# EAGLE design TCS531000_ROM-el_v1 (EAGLE 7.7.0)
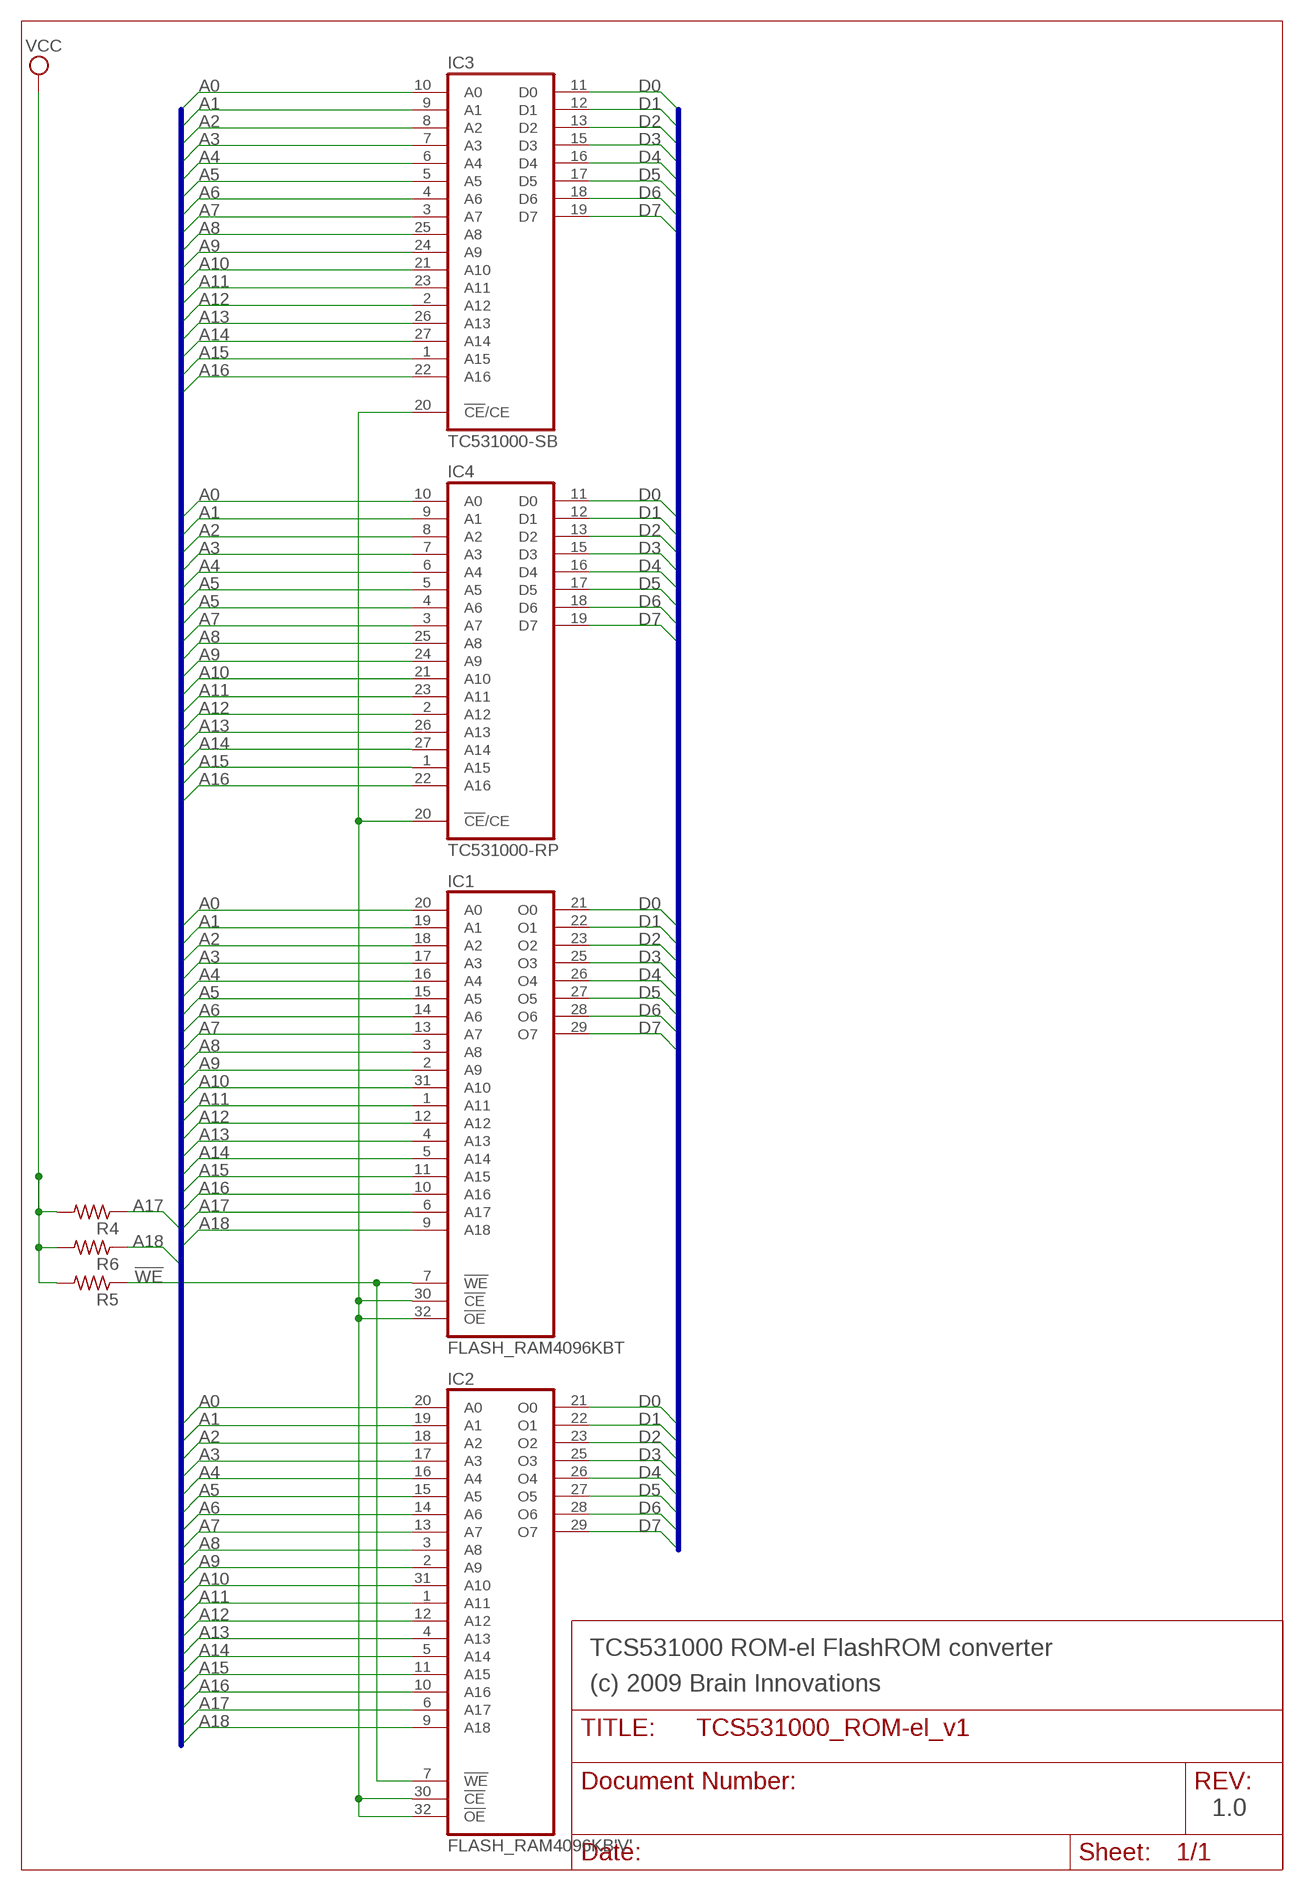
[diagram p0: schematic, sheet 1]

## Parts
IC1  FLASH_RAM4096KBT  FLASH_RAM4096KB'T'  [TSOP32]
IC2  FLASH_RAM4096KB'V'  [VSOP32]
IC3  TC531000-SB  [DIL28-SMD-REVERSE]
IC4  TC531000-RP  [DIL28-ROUNDPAD]
R4  R-US_R0805  [R0805]
R5  R-US_R0805  [R0805]
R6  R-US_R0805  [R0805]

## Nets
!WE: IC1.7(!WE) IC2.7(!WE) R5.1
A0: IC1.20(A0) IC2.20(A0) IC3.10(A0) IC4.10(A0)
A1: IC1.19(A1) IC2.19(A1) IC3.9(A1) IC4.9(A1)
A2: IC1.18(A2) IC2.18(A2) IC3.8(A2) IC4.8(A2)
A3: IC1.17(A3) IC2.17(A3) IC3.7(A3) IC4.7(A3)
A4: IC1.16(A4) IC2.16(A4) IC3.6(A4) IC4.6(A4)
A5: IC1.15(A5) IC2.15(A5) IC3.5(A5) IC4.5(A5)
A6: IC1.14(A6) IC2.14(A6) IC3.4(A6) IC4.4(A6)
A7: IC1.13(A7) IC2.13(A7) IC3.3(A7) IC4.3(A7)
A8: IC1.3(A8) IC2.3(A8) IC3.25(A8) IC4.25(A8)
A9: IC1.2(A9) IC2.2(A9) IC3.24(A9) IC4.24(A9)
A10: IC1.31(A10) IC2.31(A10) IC3.21(A10) IC4.21(A10)
A11: IC1.1(A11) IC2.1(A11) IC3.23(A11) IC4.23(A11)
A12: IC1.12(A12) IC2.12(A12) IC3.2(A12) IC4.2(A12)
A13: IC1.4(A13) IC2.4(A13) IC3.26(A13) IC4.26(A13)
A14: IC1.5(A14) IC2.5(A14) IC3.27(A14) IC4.27(A14)
A15: IC1.11(A15) IC2.11(A15) IC3.1(A15) IC4.1(A15)
A16: IC1.10(A16) IC2.10(A16) IC3.22(A16) IC4.22(A16)
A17: IC1.6(A17) IC2.6(A17) R4.1
A18: IC1.9(A18) IC2.9(A18) R6.1
D0: IC1.21(O0) IC2.21(O0) IC3.11(D0) IC4.11(D0)
D1: IC1.22(O1) IC2.22(O1) IC3.12(D1) IC4.12(D1)
D2: IC1.23(O2) IC2.23(O2) IC3.13(D2) IC4.13(D2)
D3: IC1.25(O3) IC2.25(O3) IC3.15(D3) IC4.15(D3)
D4: IC1.26(O4) IC2.26(O4) IC3.16(D4) IC4.16(D4)
D5: IC1.27(O5) IC2.27(O5) IC3.17(D5) IC4.17(D5)
D6: IC1.28(O6) IC2.28(O6) IC3.18(D6) IC4.18(D6)
D7: IC1.29(O7) IC2.29(O7) IC3.19(D7) IC4.19(D7)
N$1: IC1.30(!CE) IC1.32(!OE) IC2.30(!CE) IC2.32(!OE) IC3.20(!CE!/CE) IC4.20(!CE!/CE)
VCC: R4.2 R5.2 R6.2

## Buses
A[0..18]
D[0..7]

## Notes on the sheet
- TCS531000 ROM-el FlashROM converter
- (c) 2009 Brain Innovations
- 1.0

## Power pins joined to a net without a drawn wire
GND: IC1.24(GND) IC2.24(GND) IC3.14(GND) IC4.14(GND)
VCC: IC1.8(VCC) IC2.8(VCC) IC3.28(VCC) IC4.28(VCC)

## Library data of the parts
IC1 IC2 = memory-jedec:FLASH_RAM4096KB
IC3 IC4 = memory-toshiba-jlb:TC531000: MEMORY
R4-R6 = resistor:R-US_: RESISTOR, American symbol

## Board
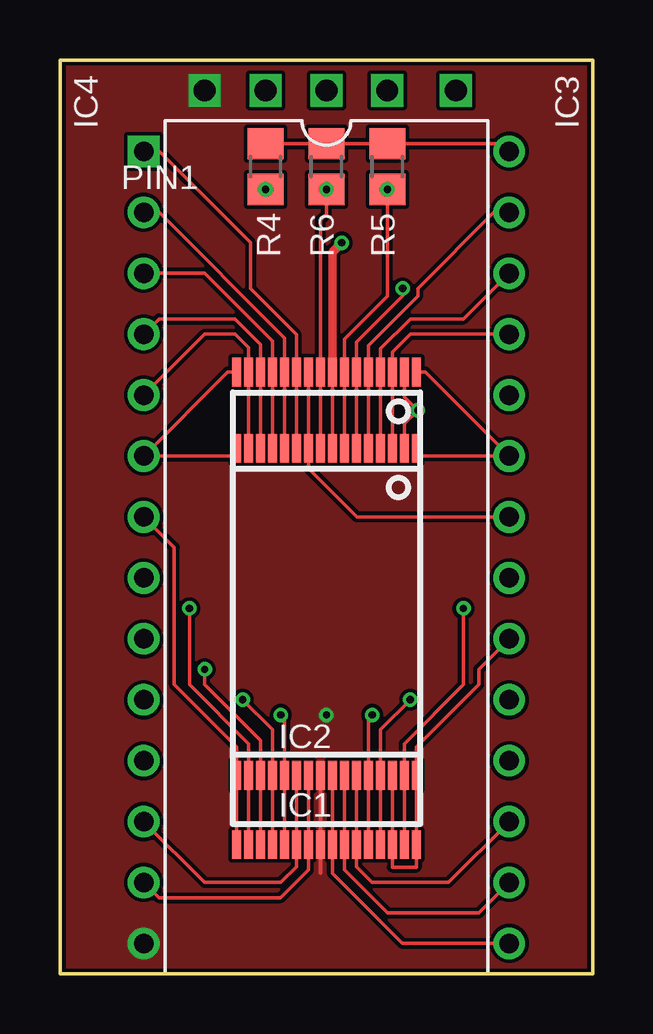
[diagram p1: board, top side]
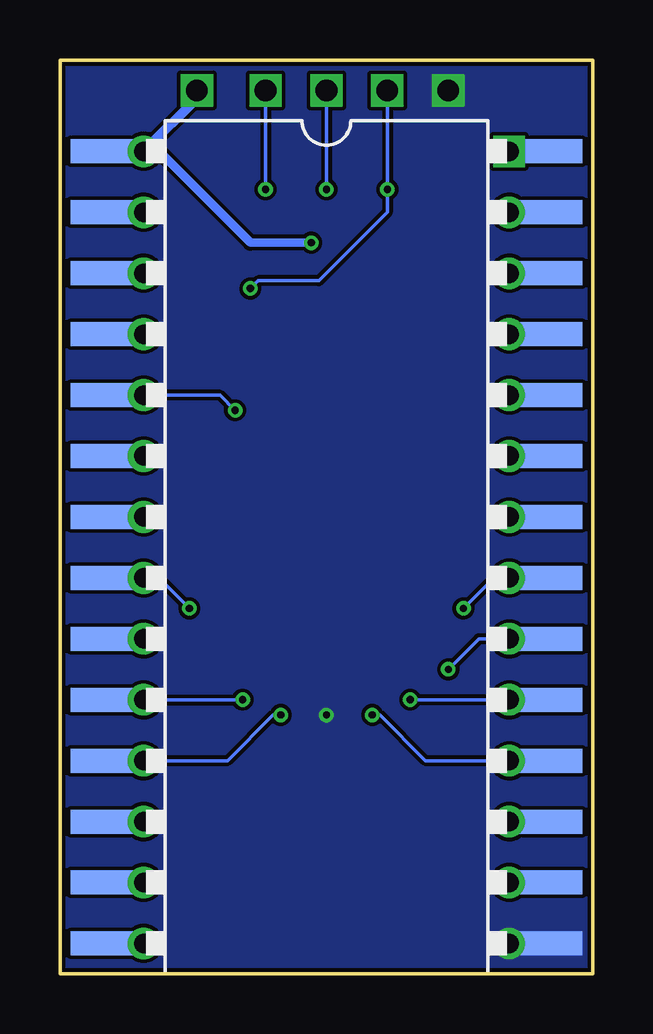
[diagram p2: board, bottom side, seen from below]

Size 22.23 x 38.1 mm. Coordinates in mm from the lower left corner, seen from the top.
Outline: 0,0 22.23,0 22.23,38.1 0,38.1 0,0
Copper layers (1*16): Top 0.035mm / dielectric 1.5mm / Bottom 0.035mm
Design rules "hackvana *": minimum track width 6mil, minimum drill 0.3mm, track to track 6mil, track to pad 6mil, pad to pad 6mil, via to via 6mil, smd to smd 0mil, copper to edge 6mil, drill to drill 6mil, minimum pad ring 10mil, minimum via ring 6mil, stop-mask expansion 2mil, vias tented up to drill 100mil, thermal gap 10mil

### Footprints (pad centres in the part's own frame; a part is rotated, then mirrored left to right if it is on the bottom)
TSOP32 = smd 1.2 x 0.36: 1 -9.85,3.75; 2 -9.85,3.25; 3 -9.85,2.75; 4 -9.85,2.25; 5 -9.85,1.75; 6 -9.85,1.25; 7 -9.85,0.75; 8 -9.85,0.25; 9 -9.85,-0.25; 10 -9.85,-0.75; 11 -9.85,-1.25; 12 -9.85,-1.75; 13 -9.85,-2.25; 14 -9.85,-2.75; 15 -9.85,-3.25; 16 -9.85,-3.75; 17 9.85,-3.75; 18 9.85,-3.25; 19 9.85,-2.75; 20 9.85,-2.25; 21 9.85,-1.75; 22 9.85,-1.25; 23 9.85,-0.75; 24 9.85,-0.25; 25 9.85,0.25; 26 9.85,0.75; 27 9.85,1.25; 28 9.85,1.75; 29 9.85,2.25; 30 9.85,2.75; 31 9.85,3.25; 32 9.85,3.75
VSOP32 = smd 1.2 x 0.36: 1 -7.31,3.75; 2 -7.31,3.25; 3 -7.31,2.75; 4 -7.31,2.25; 5 -7.31,1.75; 6 -7.31,1.25; 7 -7.31,0.75; 8 -7.31,0.25; 9 -7.31,-0.25; 10 -7.31,-0.75; 11 -7.31,-1.25; 12 -7.31,-1.75; 13 -7.31,-2.25; 14 -7.31,-2.75; 15 -7.31,-3.25; 16 -7.31,-3.75; 17 6.322,-3.75; 18 6.322,-3.25; 19 6.322,-2.75; 20 6.322,-2.25; 21 6.322,-1.75; 22 6.322,-1.25; 23 6.322,-0.75; 24 6.322,-0.25; 25 6.322,0.25; 26 6.322,0.75; 27 6.322,1.25; 28 6.322,1.75; 29 6.322,2.25; 30 6.322,2.75; 31 6.322,3.25; 32 6.322,3.75
DIL28-SMD-REVERSE = smd 1 x 3.5 bottom: 1 -16.51,-8.92; 2 -13.97,-8.92; 3 -11.43,-8.92; 4 -8.89,-8.92; 5 -6.35,-8.92; 6 -3.81,-8.92; 7 -1.27,-8.92; 8 1.27,-8.92; 9 3.81,-8.92; 10 6.35,-8.92; 11 8.89,-8.92; 12 11.43,-8.92; 13 13.97,-8.92; 14 16.51,-8.92; 15 16.51,8.92; 16 13.97,8.92; 17 11.43,8.92; 18 8.89,8.92; 19 6.35,8.92; 20 3.81,8.92; 21 1.27,8.92; 22 -1.27,8.92; 23 -3.81,8.92; 24 -6.35,8.92; 25 -8.89,8.92; 26 -11.43,8.92; 27 -13.97,8.92; 28 -16.51,8.92
DIL28-ROUNDPAD = drill 0.813 square: 1 -16.51,-7.62 | drill 0.813: 2 -13.97,-7.62; 3 -11.43,-7.62; 4 -8.89,-7.62; 5 -6.35,-7.62; 6 -3.81,-7.62; 7 -1.27,-7.62; 8 1.27,-7.62; 9 3.81,-7.62; 10 6.35,-7.62; 11 8.89,-7.62; 12 11.43,-7.62; 13 13.97,-7.62; 14 16.51,-7.62; 15 16.51,7.62; 16 13.97,7.62; 17 11.43,7.62; 18 8.89,7.62; 19 6.35,7.62; 20 3.81,7.62; 21 1.27,7.62; 22 -1.27,7.62; 23 -3.81,7.62; 24 -6.35,7.62; 25 -8.89,7.62; 26 -11.43,7.62; 27 -13.97,7.62; 28 -16.51,7.62
R0805 = smd 1.3 x 1.5: 1 -0.95,0; 2 0.95,0

### Placement (x,y rotation side)
IC1  11.11,15.24 270 top
IC2  11.11,14.61 270 top
IC3  11.11,17.78 270 top
IC4  11.11,17.78 270 top
R4  8.57,33.66 90 top
R5  13.65,33.66 90 top
R6  11.11,33.66 90 top

### Tracks (layer width: path | path; a pad name or v marks a point on that pad's centre or on a via)
!WE  (via drill 0.3, 0.9)
  Top 0.152: R5.1 13.65,28.26 11.86,26.47 IC1.7 IC2.7
  Bottom 0.152: v13.65,36.83 R5.1
  other vias: 13.65,32.7
A0  (via drill 0.3)
  Top 0.152: v7.62,11.43 8.86,10.19 IC1.20 IC2.20
  Bottom 0.152: IC3.10 IC4.10 v7.62,11.43
A1  (via drill 0.3)
  Top 0.152: v6.03,12.7 6.03,12.06 8.36,9.73 IC2.19 IC1.19
  Bottom 0.152: IC3.9 IC4.9 4.76,13.97 v6.03,12.7
A2  (via drill 0.3)
  Top 0.152: v5.4,15.24 5.4,12.06 7.86,9.6 IC2.18 IC1.18
  Bottom 0.152: IC3.8 IC4.8 4.13,16.51 v5.4,15.24
A3
  Top 0.152: IC4.7 4.76,17.78 4.76,12.06 7.36,9.46 IC1.17 IC2.17
  Bottom 0.152: IC3.7 IC4.7
A4
  Top 0.152: IC1.16 6.99,25.09 IC4.6 | IC4.6 | IC4.6 7.3,21.59 7.3,21.91 IC2.16
  Bottom 0.152: IC3.6 IC4.6
A5
  Top 0.152: IC4.5 6.03,26.67 7.3,26.67 7.86,26.11 IC1.15 IC2.15
  Bottom 0.152: IC3.5 IC4.5
A6
  Top 0.152: IC4.4 4.13,27.3 7.3,27.3 8.36,26.25 IC1.14 IC2.14
  Bottom 0.152: IC3.4 IC4.4
A7
  Top 0.152: IC4.3 6.03,29.21 8.86,26.38 IC1.13 IC2.13
  Bottom 0.152: IC3.3 IC4.3
A8
  Top 0.152: IC4.25 14.61,26.67 13.86,25.93 IC1.3 IC2.3
  Bottom 0.152: IC3.25 IC4.25
A9  (via drill 0.3)
  Top 0.152: IC1.2 14.36,24.05 v14.92,23.5 14.36,22.93 IC2.2
  Bottom 0.152: v14.92,23.5 15.56,24.13 IC4.24 IC3.24
A10  (via drill 0.3)
  Top 0.152: v16.83,15.24 16.83,12.06 14.36,9.6 IC1.31 IC2.31
  Bottom 0.152: IC3.21 IC4.21 18.1,16.51 v16.83,15.24
A11
  Top 0.152: IC2.1 14.86,21.6 IC4.23 15.23,25.09 IC1.1
  Bottom 0.152: IC3.23 IC4.23
A12
  Top 0.152: IC4.2 4.13,31.75 9.36,26.52 IC1.12 IC2.12
  Bottom 0.152: IC3.2 IC4.2
A13
  Top 0.152: IC4.26 16.83,27.3 14.61,27.3 13.36,26.06 IC1.4 IC2.4
  Bottom 0.152: IC3.26 IC4.26
A14
  Top 0.152: IC2.5 IC1.5 12.86,26.2 14.92,28.26 14.92,28.57 18.1,31.75 IC4.27
  Bottom 0.152: IC3.27 IC4.27
A15
  Top 0.152: IC2.11 IC1.11 9.86,26.65 7.94,28.57 7.94,30.48 4.13,34.29 IC4.1
  Bottom 0.152: IC3.1 IC4.1
A16
  Top 0.152: IC1.10 IC2.10 10.36,21.07 12.38,19.05 IC4.22
  Bottom 0.152: IC4.22 IC3.22
A17  (via drill 0.3, 0.9)
  Top 0.152: IC2.6 IC1.6 12.36,26.33 14.29,28.26 v14.29,28.57
  Bottom 0.152: v8.57,36.83 R4.1 8.57,31.75 11.43,28.89 13.97,28.89 v14.29,28.57
  other vias: 8.57,32.7
A18  (via drill 0.3, 0.9)
  Top 0.152: IC2.9 IC1.9 10.86,31.43 11.11,31.68 R6.1
  Bottom 0.152: v11.11,36.83 R6.1
  other vias: 11.11,32.7
D0  (via drill 0.3)
  Top 0.152: v9.21,10.79 9.36,10.64 IC2.21 IC1.21
  Bottom 0.152: v9.21,10.79 8.89,10.79 6.99,8.89 IC4.11 IC3.11
D1
  Top 0.152: IC4.12 6.03,3.81 9.21,3.81 9.86,4.46 IC1.22 IC2.22
  Bottom 0.152: IC3.12 IC4.12
D2
  Top 0.152: IC4.13 4.13,3.17 9.21,3.17 10.36,4.33 IC1.23 IC2.23
  Bottom 0.152: IC3.13 IC4.13
D3
  Top 0.152: IC4.15 14.29,1.27 11.36,4.2 IC1.25 IC2.25
  Bottom 0.152: IC3.15 IC4.15
D4
  Top 0.152: IC4.16 17.46,2.54 13.65,2.54 11.86,4.33 IC1.26 IC2.26
  Bottom 0.152: IC3.16 IC4.16
D5
  Top 0.152: IC4.17 16.19,3.81 13.02,3.81 12.36,4.46 IC1.27 IC2.27
  Bottom 0.152: IC3.17 IC4.17
D6  (via drill 0.3)
  Top 0.152: v13.02,10.79 12.86,10.64 IC1.28 IC2.28
  Bottom 0.152: v13.02,10.79 13.34,10.79 15.24,8.89 IC4.18 IC3.18
D7  (via drill 0.3)
  Top 0.152: v14.61,11.43 13.36,10.19 IC1.29 IC2.29
  Bottom 0.152: IC3.19 IC4.19 v14.61,11.43
GND  (via drill 0.3, 0.9)
  Top 0.152: 10.86,4.2 IC1.24 IC2.24
  other vias: 11.11,10.79 6.03,36.83
  pour Top (no thermals): 0,38.1 22.23,38.1 22.23,0 0,0
  pour Bottom (no thermals): 0,38.1 22.23,38.1 22.23,0 0,0
N$1
  Top 0.152: IC1.32 14.86,9.46 17.46,12.06 17.46,12.7 IC4.20 | IC1.32 IC2.32 | IC1.32 14.86,4.45 13.86,4.45 IC1.30 IC2.30
  Bottom 0.152: IC3.20 IC4.20
VCC  (via drill 0.3, 0.9)
  Top 0.152: IC2.8 IC1.8 | R4.2 R5.2 | R5.2 R6.2 | R5.2 18.42,34.6 IC4.28
  Top 0.356: IC1.8 11.36,30.09 v11.75,30.48
  Bottom 0.152: IC3.28 IC4.28
  Bottom 0.356: v11.75,30.48 14.29,30.48 18.1,34.29 IC4.28
  Bottom 0.406: v16.51,36.83 16.51,36.51 IC4.28

### Text on the board
tNames: PIN1
tValues: - | 17 | 18 | !WE | + | TCS531000 | ROM-el | www.go4retro.com | (c)2025 RETRO Innovations